# EAGLE design mmcaudio-analog-in (EAGLE 6.5.0)
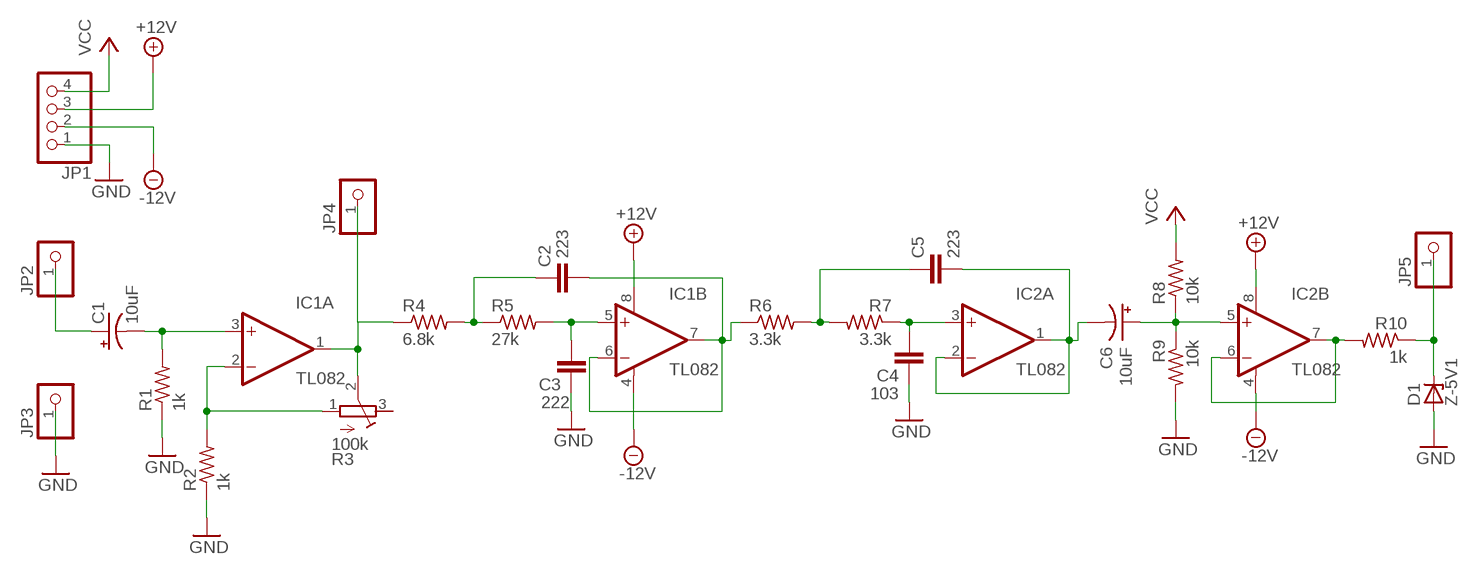
[diagram p0: schematic, sheet 1]

## Parts
C1  10uF  CPOL-USSANYO_D  [POL-CAP-COMMON]
C2  223  C-EUCERAMIC-CAP-COMMON  [C025-060X050]
C3  222  C-EUCERAMIC-CAP-COMMON  [C025-060X050]
C4  103  C-EUCERAMIC-CAP-COMMON  [C025-060X050]
C5  223  C-EUCERAMIC-CAP-COMMON  [C025-060X050]
C6  10uF  CPOL-USSANYO_D  [POL-CAP-COMMON]
D1  Z-5V1  [DO35Z7]
IC1  TL082  [DIP08]
IC2  TL082  [DIP08]
JP1  PINHD-1X4  [1X04]
JP2  PINHD-1X1  [1X01]
JP3  PINHD-1X1  [1X01]
JP4  PINHD-1X1  [1X01]
JP5  PINHD-1X1  [1X01]
R1  1k  R-US_0207/10  [R-US-COMMON]
R2  1k  R-US_0207/10  [R-US-COMMON]
R3  100k  R-TRIMM64W  [RTRIM-COMMON]
R4  6.8k  R-US_0207/10  [R-US-COMMON]
R5  27k  R-US_0207/10  [R-US-COMMON]
R6  3.3k  R-US_0207/10  [R-US-COMMON]
R7  3.3k  R-US_0207/10  [R-US-COMMON]
R8  10k  R-US_0207/10  [R-US-COMMON]
R9  10k  R-US_0207/10  [R-US-COMMON]
R10  1k  R-US_0207/10  [R-US-COMMON]

## Nets
+12V: IC1.8(B:V+) IC2.8(B:V+) JP1.3
-12V: IC1.4(B:V-) IC2.4(B:V-) JP1.2
GND: C3.1 C4.1 D1.A JP1.1 JP3.1 R1.1 R2.1 R9.2
N$1: C1.- IC1.3(A:+IN) R1.2
N$2: IC1.2(A:-IN) R2.2 R3.1(A)
N$3: IC1.1(A:OUT) JP4.1 R3.2(S) R4.1
N$4: C2.1 R4.2 R5.1
N$5: C3.2 IC1.5(B:+IN) R5.2
N$6: C2.2 IC1.6(B:-IN) IC1.7(B:OUT) R6.1
N$7: C5.1 R6.2 R7.2
N$8: C4.2 IC2.3(A:+IN) R7.1
N$9: C5.2 C6.- IC2.1(A:OUT) IC2.2(A:-IN)
N$10: C6.+ IC2.5(B:+IN) R8.1 R9.1
N$11: IC2.6(B:-IN) IC2.7(B:OUT) R10.2
N$12: D1.C JP5.1 R10.1
N$13: C1.+ JP2.1
VCC: JP1.4 R8.2
Unconnected: R3.3(E)

## Library data of the parts
C1 C6 = datle-discrete:CPOL-US: POLARIZED CAPACITOR, American symbol
C2-C5 = datle-discrete:C-EU: CAPACITOR, European symbol
D1 = datle-discrete:Z-5V1
IC1 IC2 = datle-analogic:TL082
JP1 = pinhead:PINHD-1X4: PIN HEADER
JP2-JP5 = datle-conn:PINHD-1X1: PIN HEADER
R1 R2 R4-R10 = datle-discrete:R-US_: RESISTOR, American symbol
R3 = datle-discrete:R-TRIMM: Trimm resistor

## Board
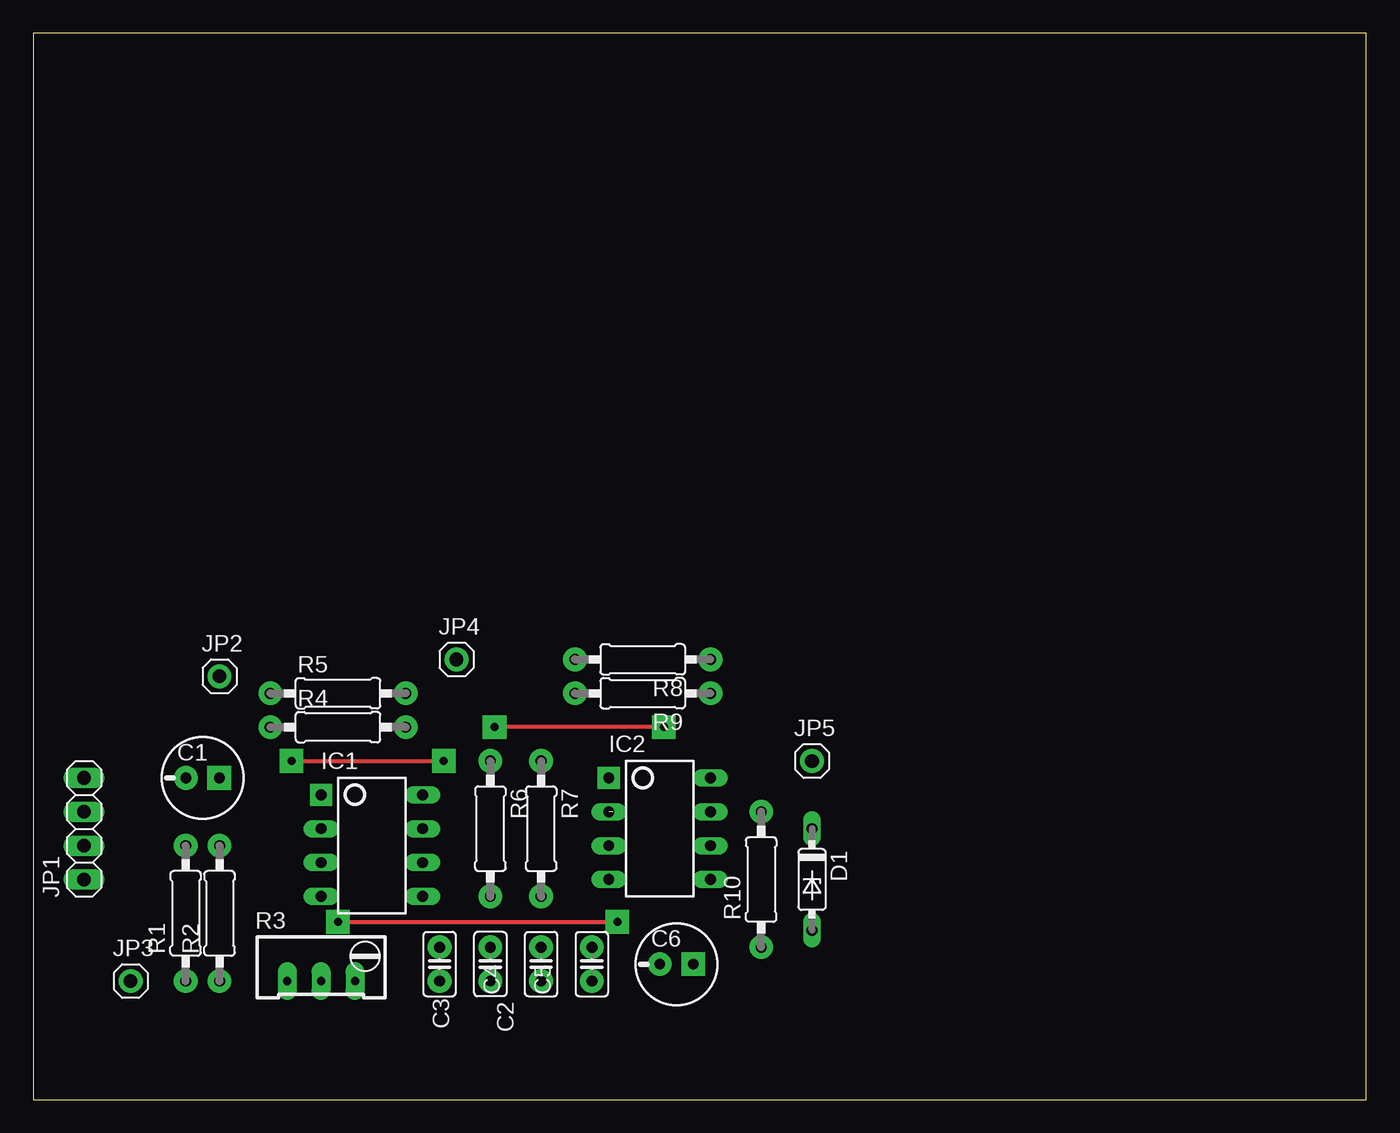
[diagram p1: board, top side]
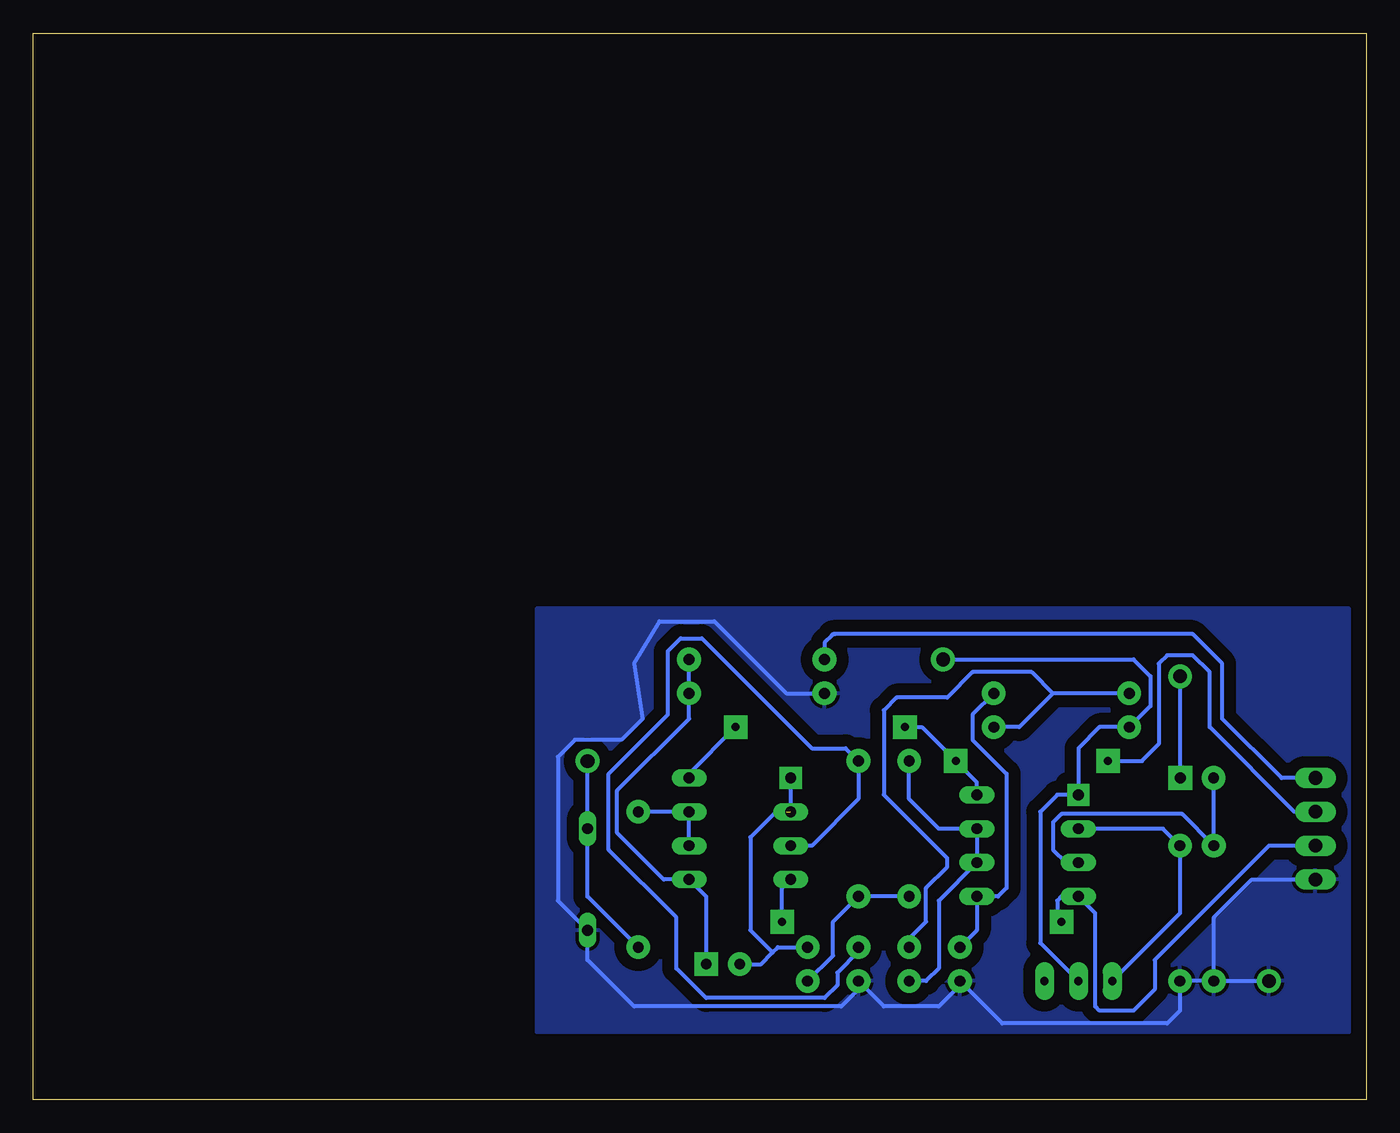
[diagram p2: board, bottom side, seen from below]

Size 100 x 80 mm. Coordinates in mm from the lower left corner, seen from the top.
Outline: 0,0 100,0 100,80 0,80 0,0
Copper layers (1*16): Top 0.035mm / dielectric 1.5mm / Bottom 0.035mm
Design rules "default": minimum track width 10mil, minimum drill 24mil, track to track 8mil, track to pad 8mil, pad to pad 8mil, via to via 8mil, smd to smd 8mil, copper to edge 40mil, drill to drill 8mil, minimum pad ring 10mil, minimum via ring 8mil, stop-mask expansion 4mil, vias tented up to drill 0mil, thermal gap 10mil

### Footprints (pad centres in the part's own frame; a part is rotated, then mirrored left to right if it is on the bottom)
POL-CAP-COMMON = drill 0.8 pad 1.778 square: + 1.25,0 | drill 0.8 pad 1.778: - -1.25,0
C025-060X050 = drill 0.813 pad 1.778: 1 -1.27,0; 2 1.27,0
DO35Z7 = drill 0.813 long: A 3.81,0; C -3.81,0
DIP08 = drill 0.813 pad 1.676 square: 1 -3.81,-3.81 | drill 0.813 pad 1.27 long: 2 -1.27,-3.81; 3 1.27,-3.81; 4 3.81,-3.81; 5 3.81,3.81; 6 1.27,3.81; 7 -1.27,3.81; 8 -3.81,3.81
1X04 = drill 1.016 long: 1 -3.81,0; 2 -1.27,0; 3 1.27,0; 4 3.81,0
1X01 = drill 1.016 pad 1.778: 1 0,0
R-US-COMMON = drill 0.813 pad 1.778: 1 -5.08,0; 2 5.08,0
RTRIM-COMMON = drill 0.61 pad 1.422 long: 1 1.27,-2.54; 2 1.27,0; 3 1.27,2.54

### Placement (x,y rotation side)
C1  12.7,24.13 0 top
C2  34.29,10.16 270 top
C3  30.48,10.16 90 top
C4  38.1,10.16 90 top
C5  41.91,10.16 90 top
C6  48.26,10.16 0 top
D1  58.42,16.51 270 top
IC1  25.4,19.05 270 top
IC2  46.99,20.32 270 top
JP1  3.81,20.32 90 top
JP2  13.97,31.75 0 top
JP3  7.3,8.89 0 top
JP4  31.75,33.02 0 top
JP5  58.42,25.4 0 top
R1  11.43,13.97 90 top
R2  13.97,13.97 90 top
R3  21.59,10.16 270 top
R4  22.86,27.94 0 top
R5  22.86,30.48 0 top
R6  34.29,20.32 270 top
R7  38.1,20.32 270 top
R8  45.72,33.02 180 top
R9  45.72,30.48 180 top
R10  54.61,16.51 90 top

### Tracks (layer width: path | path; a pad name or v marks a point on that pad's centre or on a via)
+12V  (via drill 0.6 pad 1.78)
  Top 0.305: v47.31,27.94 v34.61,27.94 | v19.37,25.4 v30.8,25.4
  Bottom 0.305: JP1.3 5.4,21.59 11.75,27.94 11.75,32.07 13.02,33.34 14.92,33.34 15.56,32.7 15.56,26.67 16.83,25.4 v19.37,25.4 | IC2.8 50.8,24.45 v47.31,27.94 | IC1.8 29.21,23.81 v30.8,25.4 33.34,27.94 v34.61,27.94
-12V  (via drill 0.6 pad 1.78)
  Top 0.305: v22.86,13.34 v43.81,13.34
  Bottom 0.305: JP1.2 7.3,19.05 15.88,10.48 15.88,8.26 17.46,6.67 20,6.67 20.32,6.99 20.32,13.97 IC1.4 22.86,15.24 23.18,14.92 23.18,13.65 v22.86,13.34 | v43.81,13.34 43.81,15.88 IC2.4
GND
  Bottom 0.305: R1.1 R2.1 13.97,6.67 14.92,5.71 27.3,5.71 C3.1 30.48,8.57 32.07,6.99 36.2,6.99 C4.1 38.1,8.26 39.37,6.99 54.93,6.99 58.42,10.48 D1.A 60.64,14.92 60.64,25.72 59.37,26.99 55.88,26.99 54.29,28.57 54.93,32.7 53.02,35.88 48.9,35.88 43.5,30.48 R9.2 | R1.1 11.43,13.65 8.57,16.51 JP1.1 | R1.1 JP3.1
  pour Bottom (isolate 0.889): 2.54,36.83 62.23,36.83 62.23,5.08 1.27,5.08 1.27,36.83
N$1
  Bottom 0.305: C1.- 11.45,19.05 R1.2 13.81,21.43 22.86,21.43 23.5,20.8 23.5,18.73 22.54,17.78 IC1.3
N$2
  Bottom 0.305: R3.1 13.97,13.97 R2.2 15.24,20.32 IC1.2
N$3
  Bottom 0.305: R3.2 24.45,11.75 24.45,21.59 23.18,22.86 IC1.1 21.59,26.35 20,27.94 R4.1 16.19,29.53 16.19,31.75 17.46,33.02 JP4.1
N$4
  Bottom 0.305: R5.1 23.5,30.48 | 23.5,30.48 26.04,27.94 R4.2 | C2.1 34.29,12.06 33.02,13.34 33.02,15.88 31.43,17.46 31.43,18.1 36.2,22.86 36.2,29.21 35.24,30.16 31.43,30.16 29.53,32.07 25.08,32.07 23.5,30.48
N$5
  Bottom 0.305: R5.2 29.53,28.89 29.53,26.99 26.99,24.45 26.99,15.88 27.62,15.24 IC1.5 29.21,12.7 C3.2
N$6
  Bottom 0.305: C2.2 33.02,8.89 32.07,9.84 32.07,14.92 IC1.6 IC1.7 32.07,20.32 34.29,22.54 R6.1
N$7
  Bottom 0.305: C5.1 40.01,10.79 40.01,13.34 R7.2 R6.2
N$8
  Bottom 0.305: C4.2 38.1,11.11 39.69,9.53 39.69,8.57 40.64,7.62 49.53,7.62 51.75,9.84 51.75,13.65 56.83,18.73 56.83,24.45 52.39,28.89 52.39,33.66 51.44,34.61 49.85,34.61 41.59,26.35 39.05,26.35 R7.1 38.1,22.54 41.59,19.05 IC2.3
N$9  (1 unrouted)
  Bottom 0.305: C6.- 45.4,10.16 44.53,11.03 | 44.53,11.03 44.13,11.43 C5.2 | IC2.1 IC2.2 | 43.5,21.59 44.29,21.59 46.2,19.68 46.2,12.7 44.53,11.03
N$10
  Bottom 0.305: R8.1 R9.1 50.8,28.57 56.2,23.18 56.2,20 52.7,16.51 IC2.5 49.51,15.22 C6.+
N$11
  Bottom 0.305: R10.2 IC2.7 IC2.6
N$12
  Bottom 0.305: R10.1 58.42,15.24 D1.C JP5.1
N$13
  Bottom 0.305: C1.+ 13.95,31.73 JP2.1
VCC
  Bottom 0.305: JP1.4 6.35,24.13 10.79,28.57 10.79,32.7 13.02,34.92 39.87,34.92 arc-45 40.1,34.83 40.64,34.29 R8.2